# EAGLE design ir_blaster (EAGLE 9.1.2)
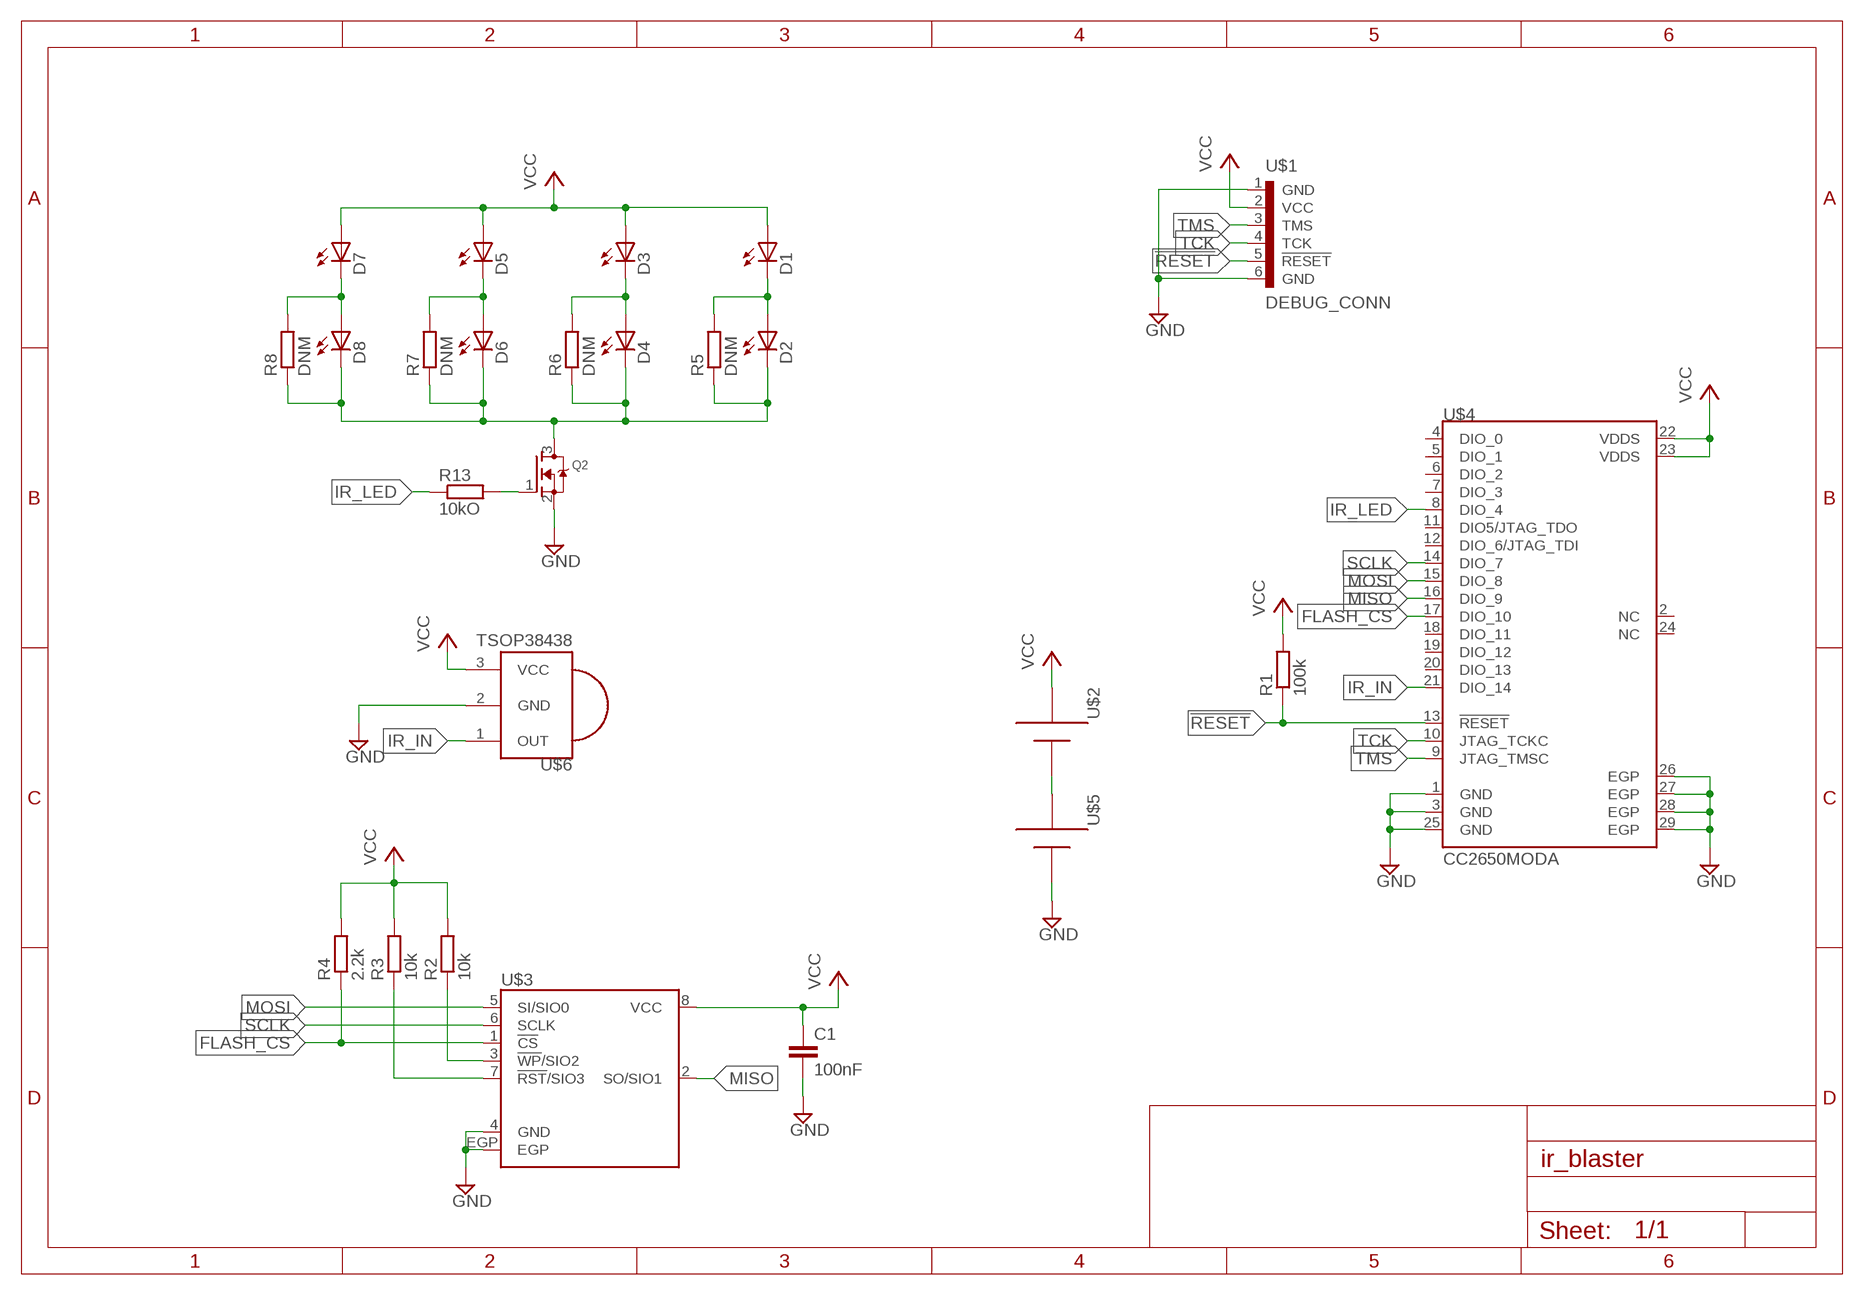
[diagram p0: schematic, sheet 1]

## Parts
C1  100nF  CAPACITOR_0402  [0402]
D1  SFH482  [SFH482]
D2  SFH482  [SFH482]
D3  SFH482  [SFH482]
D4  SFH482  [SFH482]
D5  SFH482  [SFH482]
D6  SFH482  [SFH482]
D7  SFH482  [SFH482]
D8  SFH482  [SFH482]
Q2  MOSFET-NREFLOW  [SOT23]
R1  100k  RESISTOR_0402  [0402]
R2  10k  RESISTOR_0402  [0402]
R3  10k  RESISTOR_0402  [0402]
R4  2.2k  RESISTOR_0402  [0402]
R5  DNM  RESISTOR_0402  [0402]
R6  DNM  RESISTOR_0402  [0402]
R7  DNM  RESISTOR_0402  [0402]
R8  DNM  RESISTOR_0402  [0402]
R13  10kO  RESISTOR_0402  [0402]
U$1  DEBUG_CONN  [DEBUG_CONN]
U$2  AA  [AA]
U$3  MX25R8035FMX25R8035FZUIL0  [MX25R8035FZUIL0]
U$4  CC2650MODA  [CC2650MODA]
U$5  AA  [AA]
U$6  TSOP38438  PNA460XM  [PNA460XM]

## Nets
!RESET: R1.1 U$1.5(!RESET) U$4.13(!RESET)
FLASH_CS: R4.1 U$3.1(!CS) U$4.17(DIO_10)
GND: C1.2 Q2.2(S) U$1.1(GND) U$1.6(GND) U$3.4(GND) U$3.EGP U$4.1(GND) U$4.3(GND) U$4.25(GND) U$4.26(EGP) U$4.27(EGP) U$4.28(EGP) U$4.29(EGP) U$5.- U$5.-@1(-) U$5.-@2(-) U$5.-@3(-) U$6.2(GND)
IR_IN: U$4.21(DIO_14) U$6.1(OUT)
IR_LED: R13.1 U$4.8(DIO_4)
MISO: U$3.2(SO/SIO1) U$4.16(DIO_9)
MOSI: U$3.5(SI/SIO0) U$4.15(DIO_8)
N$1: R2.1 U$3.3(!WP!/SIO2)
N$2: R3.1 U$3.7(!RST!/SIO3)
N$3: U$2.- U$2.-@1(-) U$2.-@2(-) U$2.-@3(-) U$5.+ U$5.+@1(+) U$5.+@2(+) U$5.+@3(+)
N$5: D1.K(C) D2.A R5.2
N$8: D3.K(C) D4.A R6.2
N$10: D5.K(C) D6.A R7.2
N$12: D7.K(C) D8.A R8.2
N$14: Q2.1(G) R13.2
N$15: D2.K(C) D4.K(C) D6.K(C) D8.K(C) Q2.3(D) R5.1 R6.1 R7.1 R8.1
SCLK: U$3.6(SCLK) U$4.14(DIO_7)
TCK: U$1.4(TCK) U$4.10(JTAG_TCKC)
TMS: U$1.3(TMS) U$4.9(JTAG_TMSC)
VCC: C1.1 D1.A D3.A D5.A D7.A R1.2 R2.2 R3.2 R4.2 U$1.2(VCC) U$2.+ U$2.+@1(+) U$2.+@2(+) U$2.+@3(+) U$3.8(VCC) U$4.22(VDDS) U$4.23(VDDS) U$6.3(VCC)
Unconnected: U$4.2(NC) U$4.4(DIO_0) U$4.5(DIO_1) U$4.6(DIO_2) U$4.7(DIO_3) U$4.11(DIO5/JTAG_TDO) U$4.12(DIO_6/JTAG_TDI) U$4.18(DIO_11) U$4.19(DIO_12) U$4.20(DIO_13) U$4.24(NC)

## Library data of the parts
C1 = mine:CAPACITOR
D1-D8 = led:SFH482: IR LED infrared emitting diode, Infineon
Q2 = adafruit:MOSFET-N: N-Channel Mosfet 2N7002E - 60V 260mA SOT23 [Digikey: 2N7002ET1GOSTR-ND] - REEL BSH103 - 30V 850mA SOT23 [Digikey: 568-5013-1-ND]
R1-R8 R13 = mine:RESISTOR
U$1 = mine:DEBUG_CONN
U$2 U$5 = mine:AA
U$3 = mine:MX25R8035F
U$4 = mine:CC2650MODA
U$6 = adafruit:PNA460XM: IR 38KHz receiver PNA4602 and related receivers http://www.ladyada.net/library/pcb/eaglelibrary.html

## Board
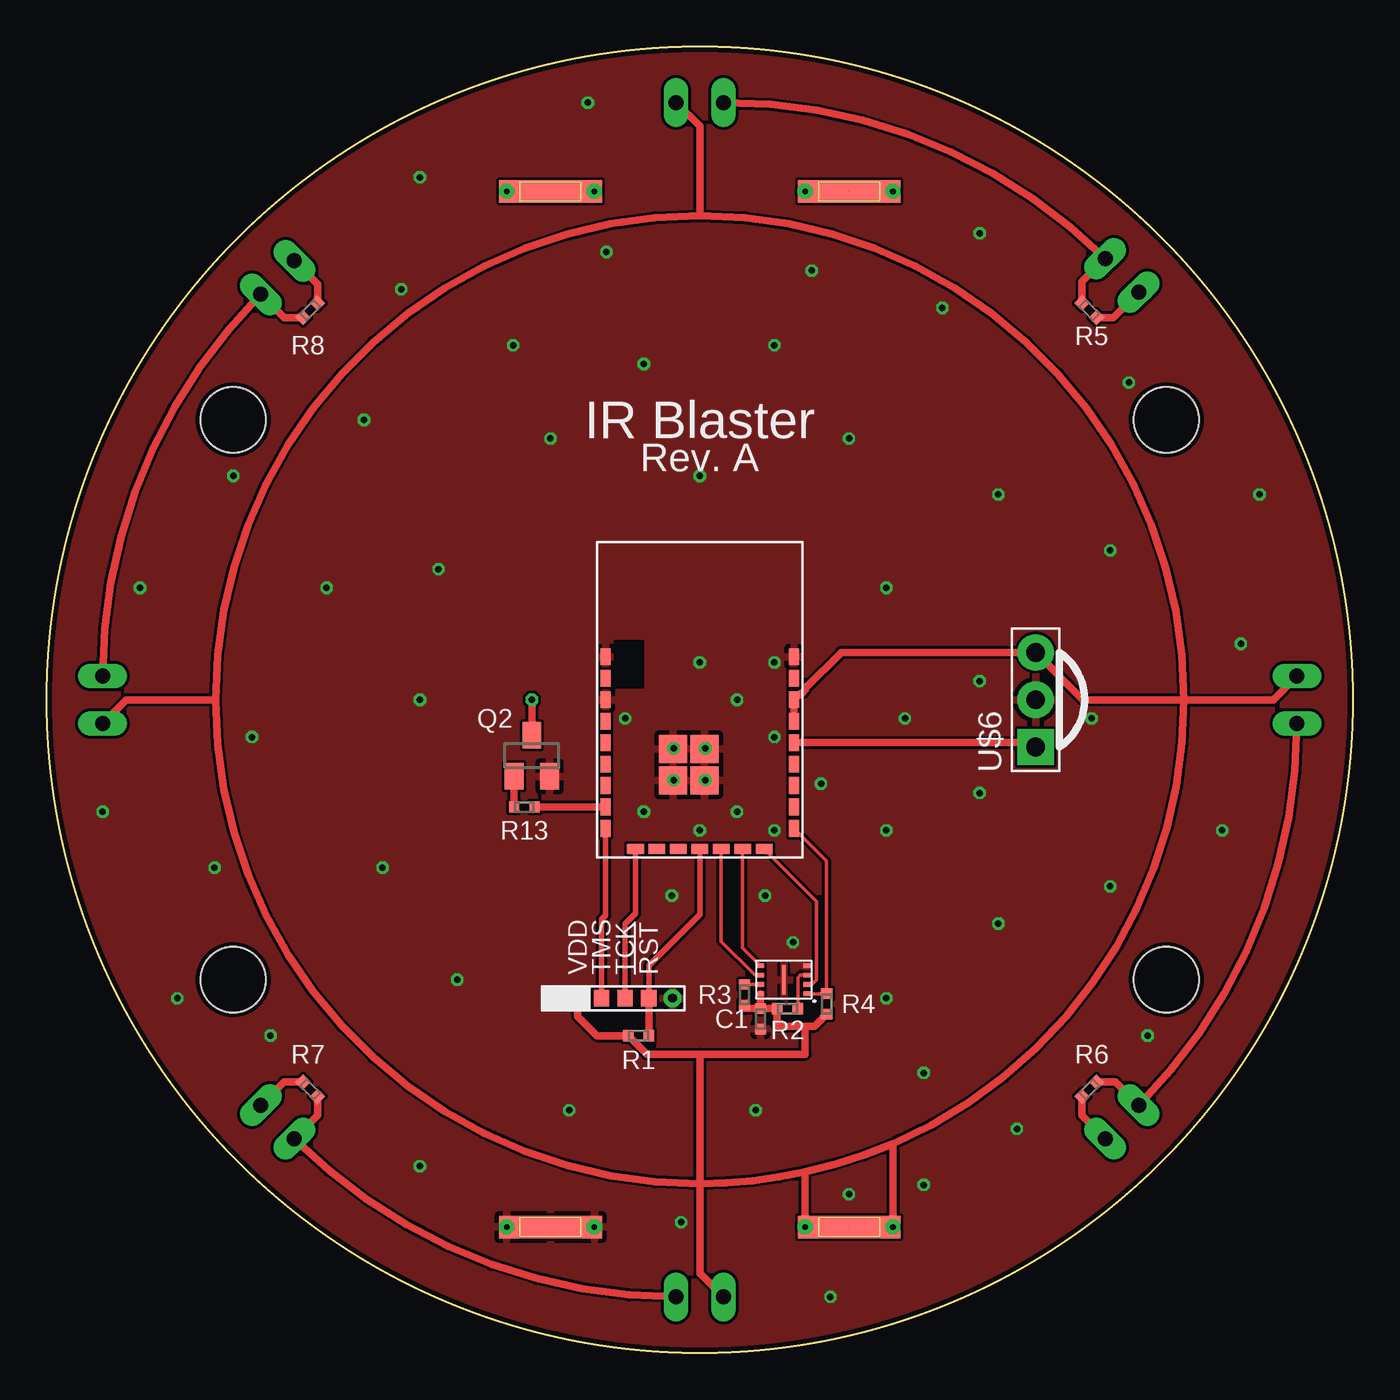
[diagram p1: board, top side]
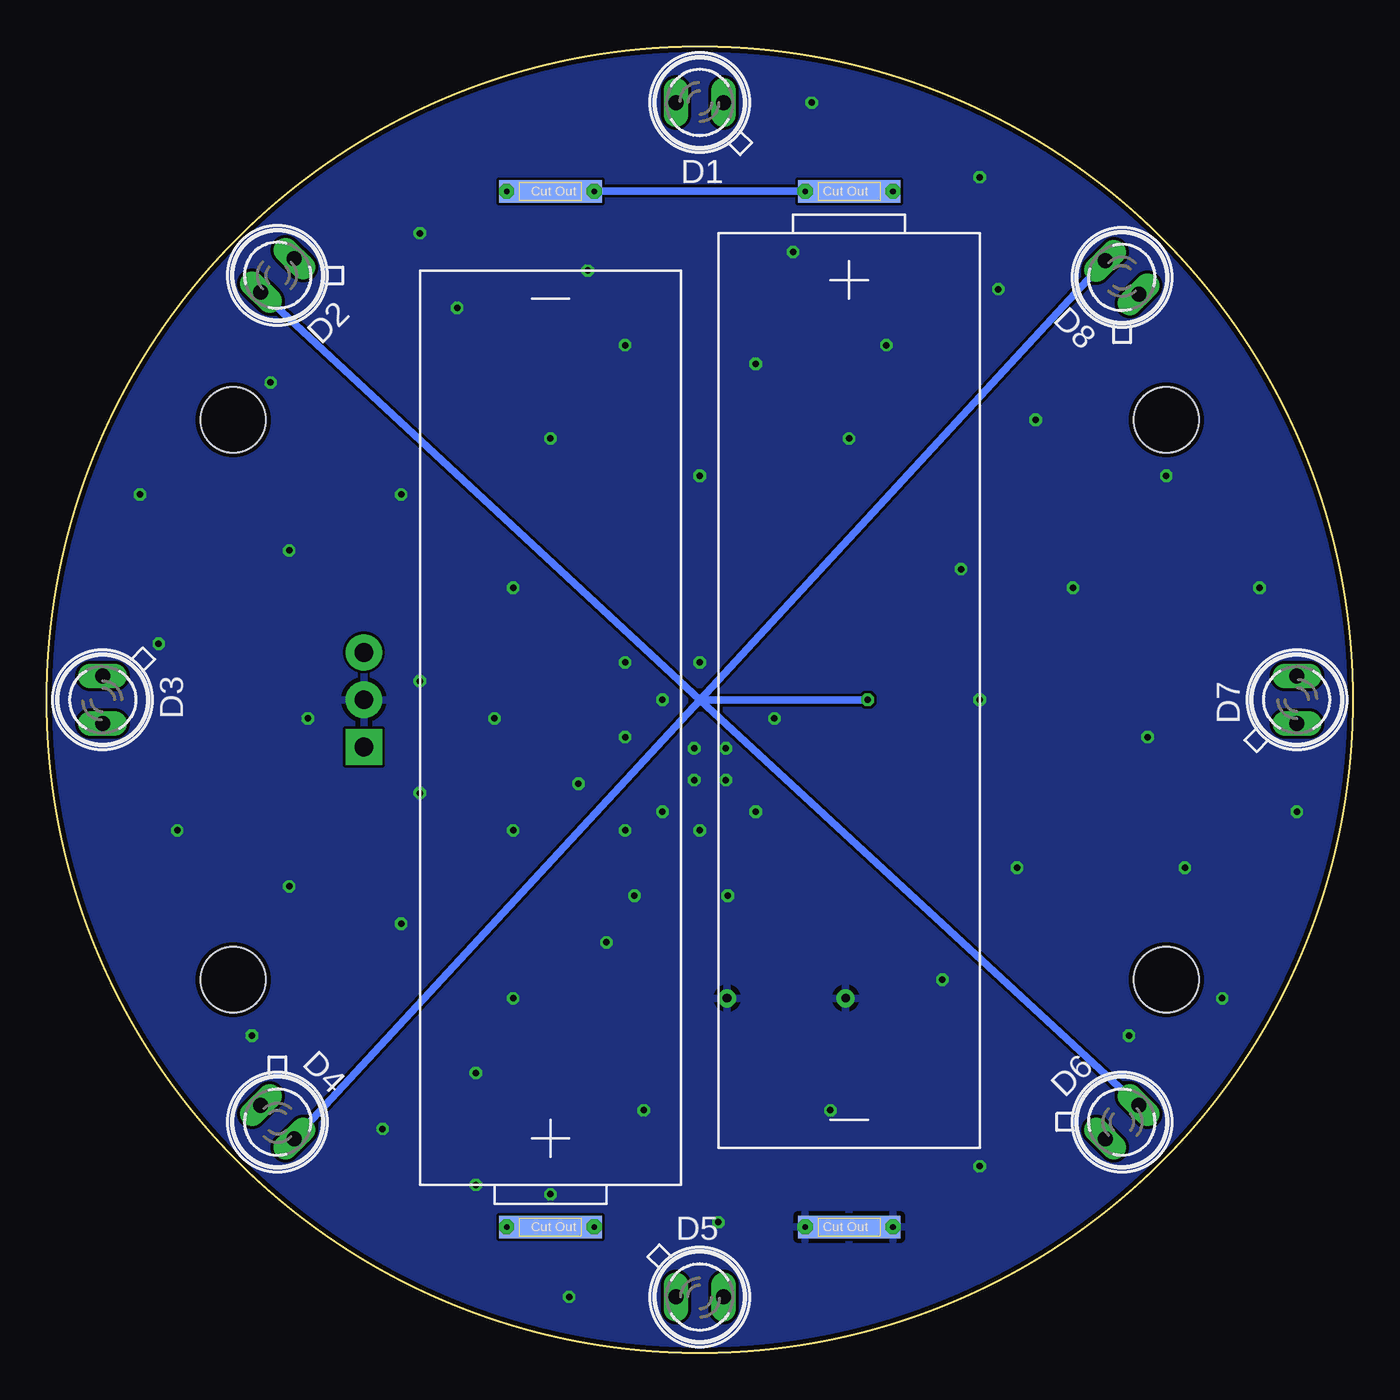
[diagram p2: board, bottom side, seen from below]

Size 70 x 70 mm. Coordinates in mm from the lower left corner, seen from the top.
Outline: circle at 35,35 radius 35
Copper layers (1*16): Top 0.035mm / dielectric 1.5mm / Bottom 0.035mm
Design rules "SeeedStudio_2layer_DRU_no_angle_20140221_fixed_drill_size": minimum track width 6mil, minimum drill 0.3mm, track to track 6mil, track to pad 6mil, pad to pad 6mil, via to via 6mil, smd to smd 0mil, copper to edge 10mil, drill to drill 10mil, minimum pad ring 10mil, minimum via ring 6mil, stop-mask expansion 2mil, vias tented up to drill 100mil, thermal gap 10mil
Holes 3.5 mm at 10,20 10,50 60,50 60,20

### Footprints (pad centres in the part's own frame; a part is rotated, then mirrored left to right if it is on the bottom)
0402 = smd 0.55 x 0.6: 1 -0.55,0; 2 0.55,0
SFH482 = drill 0.813 long: A -1.27,0; K 1.27,0
SOT23 = smd 1 x 1.4: 1 -0.95,-1.1; 2 0.95,-1.1; 3 0,1.1
DEBUG_CONN = drill 0.457: 1 0,3.81; 6 0,-2.54 | smd 0.889 x 0.813: 2 0,2.54; 3 0,1.27; 4 0,0; 5 0,-1.27
AA = drill 0.3 octagon: + -2.35,26.25; +@3 2.35,26.25; - -2.35,-29.25; -@3 2.35,-29.25 | smd 5.5 x 1.2: +@1 0,26.25; -@1 0,-29.25 | smd 5.5 x 1.2 bottom: +@2 0,26.25; -@2 0,-29.25
MX25R8035FZUIL0 = smd 0.25 x 0.4: 1 0.75,1.25; 2 0.25,1.25; 3 -0.25,1.25; 4 -0.75,1.25; 5 -0.75,-1.25; 6 -0.25,-1.25; 7 0.25,-1.25; 8 0.75,-1.25 | smd 1.6 x 0.2: EGP 0,0
CC2650MODA = smd 0.55 x 0.9: 1 -5.05,2.3; 2 -5.05,1.15; 3 -5.05,0; 4 -5.05,-1.15; 5 -5.05,-2.3; 6 -5.05,-3.45; 7 -5.05,-4.6; 8 -5.05,-5.75; 9 -5.05,-6.9; 17 5.05,-6.9; 18 5.05,-5.75; 19 5.05,-4.6; 20 5.05,-3.45; 21 5.05,-2.3; 22 5.05,-1.15; 23 5.05,0; 24 5.05,1.15; 25 5.05,2.3 | smd 0.9 x 0.55: 10 -3.45,-8; 11 -2.3,-8; 12 -1.15,-8; 13 0,-8; 14 1.15,-8; 15 2.3,-8; 16 3.45,-8 | smd 1.5 x 1.5: 26 -1.435,-2.625; 27 -1.435,-4.325; 28 0.265,-4.325; 29 0.265,-2.625
PNA460XM = drill 1.016 pad 1.93 square: 1 -2.54,0 | drill 1.016 pad 1.93: 2 0,0; 3 2.54,0

### Placement (x,y rotation side)
C1  38.25,17.9 270 top
D1  35,67 180 bottom
D2  57.63,57.74 225 bottom
D3  67,35 270 bottom
D4  57.63,12.37 315 bottom
D5  35,3 0 bottom
D6  12.37,12.37 45 bottom
D7  3,35 90 bottom
D8  12.37,57.63 135 bottom
Q2  26,32 0 top
R1  31.72,17 180 top
R2  39.7,18.45 180 top
R3  37.4,19.2 270 top
R4  41.8,18.7 270 top
R5  55.88,55.88 135 top
R6  55.88,14.12 45 top
R7  14.12,14.12 315 top
R8  14.12,55.88 225 top
R13  25.6,29.25 180 top
U$1  31,19 90 top
U$2  43,33 180 bottom
U$3  39.5,20 270 top
U$4  35,35 0 top
U$5  27,36 0 bottom
U$6  53,35 90 top

### Tracks (layer width: path | path; a pad name or v marks a point on that pad's centre or on a via)
!RESET
  Top 0.3: U$4.13 35,23.5 32.27,20.77 U$1.5
  Top 0.4: U$1.5 R1.1
FLASH_CS
  Top 0.2: U$3.1 R4.1 41.8,26.35 U$4.17
GND  (via drill 0.35)
  Top 0.4: U$5.-@3 U$5.-@2 U$5.-
  other vias: 38.5,24.5 40,22 33.6,30.7 35.3,30.7 33.6,32.4 35.3,32.4 37,35 39,33 39,37 37,29 39,28 35,28 32,29 31,34 35,37 43,49 39,54 48,56 50,60 41,58 30,59 32,53 27,49 19,57 17,50 21,42 15,41 5,41 11,33 20,35 18,26 9,26 12,17 22,20 20,10 28,13 34,7 38,13 47,9 52,12 45,19 45,28 51,23 59,17 57,25 63,28 50,30 46,34 50,36 45,41 51,46 57,43 56,34 64,38 58,52 25,54 20,63 29,67 65,46 42,3 7,19 3,29 10,47 41.5,30.5 33.5,24.5 43,8.5 47,15 35,47
  pour Top: 35,70 arc-90 70,35 arc-90 35,0 arc-90 0,35 arc-90
  pour Bottom: 35,70 arc-90 70,35 arc-90 35,0 arc-90 0,35 arc-90
IR_IN
  Top 0.4: U$4.21 52.76,32.7 U$6.1
IR_LED
  Top 0.4: U$4.8 R13.1
MISO
  Top 0.2: U$3.2 41,19.75 41.25,20 41.25,24.2 U$4.16
MOSI
  Top 0.2: U$4.15 37.3,21.7 U$3.5
N$1
  Top 0.2: U$3.3 40.4,20.25 40.25,20.1 R2.1
N$2
  Top 0.2: U$3.7 R3.1
N$3  (2 unrouted)
  Top 0.4: U$2.- U$2.-@2 U$2.-@3 | U$5.+@3 U$5.+@2 U$5.+
  Bottom 0.4: U$5.+ U$2.-
N$5
  Top 0.4: R5.2 55.49,57.4 D2.A arc45 D1.K
N$8
  Top 0.4: R6.2 57.28,14.51 D4.A arc45 D3.K
N$10
  Top 0.4: R7.2 14.51,12.71 D6.A arc45 D5.K
N$12
  Top 0.4: R8.2 12.71,55.49 D8.A arc45 D7.K
N$14
  Top 0.4: R13.2 Q2.1
N$15  (via drill 0.35)
  Top 0.4: Q2.3 v26,35 | D8.K 14.51,57.28 R8.1 | D2.K 57.17,55.49 R5.1 | D4.K 55.49,12.71 R6.1 | D6.K 12.71,14.51 R7.1
  Bottom 0.4: 35,35 D8.K | D2.K 35,35 | D4.K 35,35 | D6.K 35,35 | 35,35 v26,35
SCLK
  Top 0.2: U$3.6 37.95,20.25 36.15,22.05 U$4.14
TCK
  Top 0.3: U$4.10 31.55,23.55 31,23 U$1.4
TMS
  Top 0.3: U$4.9 29.95,23.45 29.73,23.23 U$1.3
VCC  (1 unrouted)
  Top 0.4: U$1.2 28.46,18.04 29.5,17 R1.2 32.17,16 35,16 | U$3.8 C1.1 | C1.1 R2.2 39.15,17.5 40.65,17.5 | C1.1 37.4,18.45 R3.2 | 40.65,17.5 40.65,16 35,16 | U$4.22 U$4.23 40.4,35.35 40.47,35.35 40.68,35.55 40.68,35.63 42.59,37.54 U$6.3 55.54,35 60.95,35 | 40.65,17.5 41.15,17.5 R4.2 | 40.65,9.7 U$2.+ U$2.+@2 U$2.+@3 45.35,11.2 | 45.35,11.2 arc-10 40.65,9.7 | 35,60.95 arc-90 60.95,35 | 35,60.95 35,65.73 D1.A | 60.95,35 65.73,35 D3.A | 60.95,35 arc-66 45.35,11.2 | 40.65,9.7 arc-12 35,9.05 | 35,9.05 35,4.27 D5.A | 35,9.05 arc-90 9.05,35 | 9.05,35 4.27,35 D7.A | 9.05,35 arc-90 35,60.95 | 35,9.05 35,16

### Text on the board
tPlace: IR Blaster | Rev. A